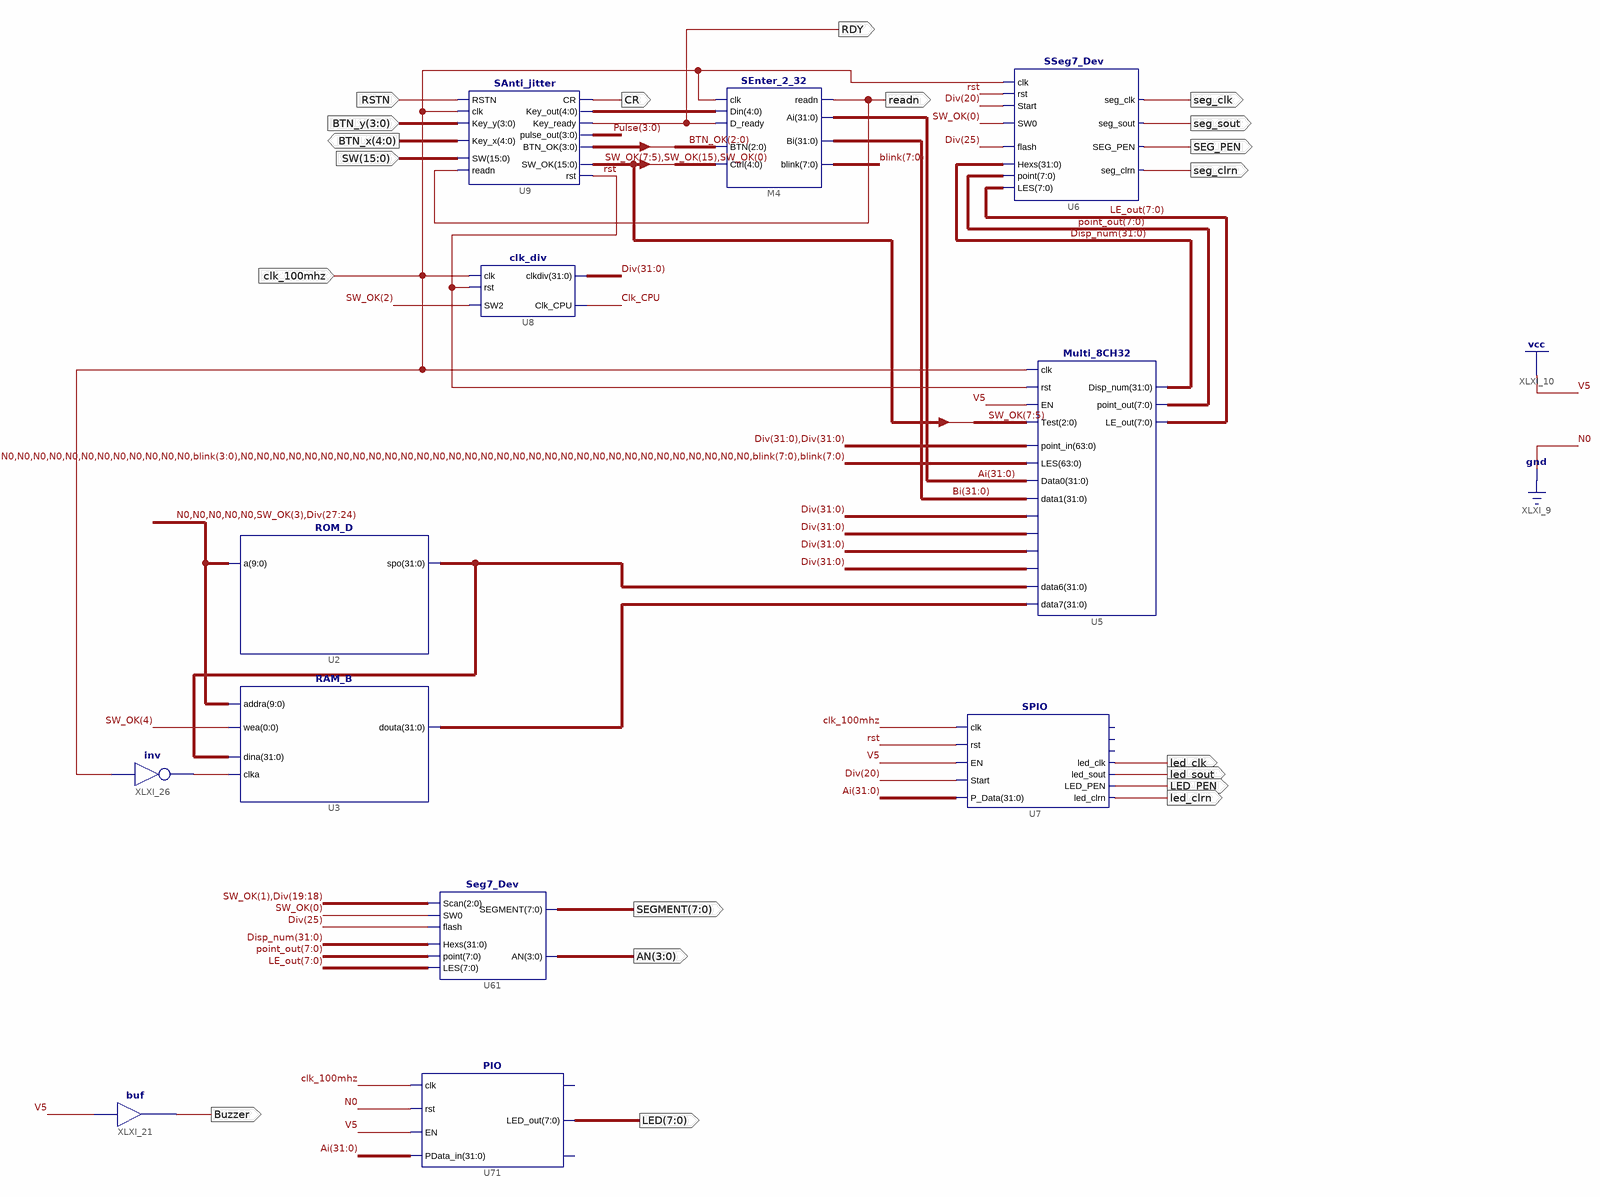
[diagram p0: schematic sheet 1]
// Xilinx ISE schematic Frame.sch (kintex7) as structural Verilog: 12 symbols, 20 ports
module Frame (
  input  RSTN,
  input  [3:0] BTN_y,
  input  [15:0] SW,
  input  clk_100mhz,
  output [4:0] BTN_x,
  output CR,
  output readn,
  output RDY,
  output seg_clk,
  output seg_sout,
  output SEG_PEN,
  output seg_clrn,
  output led_clk,
  output led_sout,
  output LED_PEN,
  output led_clrn,
  output [7:0] SEGMENT,
  output [3:0] AN,
  output [7:0] LED,
  output Buzzer
);

  wire Clk_CPU, rst, XLXN_119;
  wire [3:0] BTN_OK, Pulse;
  wire [4:0] XLXN_11;
  wire [7:0] blink, LE_out, point_out;
  wire [15:0] SW_OK;
  wire [31:0] Ai, Bi, Disp_num, Div, XLXN_121, XLXN_122;

  SAnti_jitter U9 (
    .SW(SW), .readn(readn), .Key_y(BTN_y), .Key_x(BTN_x), .RSTN(RSTN), .clk(clk_100mhz), .Key_out(XLXN_11),
    .Key_ready(RDY), .CR(CR), .rst(rst), .SW_OK(SW_OK), .pulse_out(Pulse), .BTN_OK(BTN_OK));
  clk_div U8 (.rst(rst), .clk(clk_100mhz), .SW2(SW_OK[2]), .clkdiv(Div), .Clk_CPU(Clk_CPU));
  Multi_8CH32 U5 (
    .Test(SW_OK[7:5]), .point_in({Div, Div}), .EN(1'b1), .clk(clk_100mhz), .rst(rst),
    .LES({{12{1'b0}}, blink[3:0], {32{1'b0}}, blink, blink}), .Data0(Ai), .data1(Bi), .data2(Div),
    .data3(Div), .data4(Div), .data5(Div), .data6(XLXN_121), .data7(XLXN_122), .point_out(point_out),
    .LE_out(LE_out), .Disp_num(Disp_num));
  SPIO U7 (
    .clk(clk_100mhz), .P_Data(Ai), .rst(rst), .EN(1'b1), .Start(Div[20]), .led_clk(led_clk),
    .led_clrn(led_clrn), .LED_PEN(LED_PEN), .led_sout(led_sout));  // open: GPIOf0, LED_out, counter_set
  Seg7_Dev U61 (
    .LES(LE_out), .Scan({SW_OK[1], Div[19:18]}), .SEGMENT(SEGMENT), .AN(AN), .point(point_out),
    .flash(Div[25]), .SW0(SW_OK[0]), .Hexs(Disp_num));
  PIO U71 (.clk(clk_100mhz), .rst(1'b0), .EN(1'b1), .PData_in(Ai), .LED_out(LED));  // open: GPIOf0, counter_set
  SSeg7_Dev U6 (
    .LES(LE_out), .SEG_PEN(SEG_PEN), .seg_sout(seg_sout), .seg_clrn(seg_clrn), .point(point_out),
    .Hexs(Disp_num), .SW0(SW_OK[0]), .flash(Div[25]), .seg_clk(seg_clk), .clk(clk_100mhz), .rst(rst),
    .Start(Div[20]));
  SEnter_2_32 M4 (
    .readn(readn), .Ai(Ai), .Bi(Bi), .blink(blink), .Din(XLXN_11), .D_ready(RDY), .clk(clk_100mhz),
    .Ctrl({SW_OK[7:5], SW_OK[15], SW_OK[0]}), .BTN(BTN_OK[2:0]));
  buf XLXI_21 (Buzzer, 1'b1);
  ROM_D U2 (.a({{5{1'b0}}, SW_OK[3], Div[27:24]}), .spo(XLXN_121));
  RAM_B U3 (
    .addra({{5{1'b0}}, SW_OK[3], Div[27:24]}), .clka(XLXN_119), .wea(SW_OK[4]), .dina(XLXN_121),
    .douta(XLXN_122));
  not XLXI_26 (XLXN_119, clk_100mhz);
endmodule
